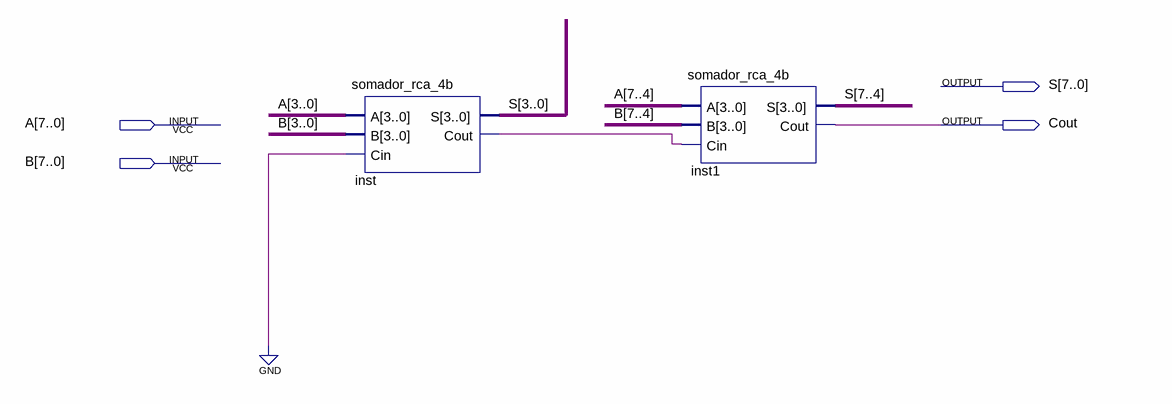
[diagram p0: schematic sheet]
// Quartus schematic somador_rca_8b.bdf as structural Verilog: 2 symbols, 4 pins
module somador_rca_8b (
  input  [7:0] A,
  input  [7:0] B,
  output [7:0] S,
  output Cout
);

  wire inst_cout;

  somador_rca_4b inst (.A(A[3:0]), .B(B[3:0]), .Cin(1'b0), .S(S[3:0]), .Cout(inst_cout));
  somador_rca_4b inst1 (.A(A[7:4]), .B(B[7:4]), .Cin(inst_cout), .S(S[7:4]), .Cout(Cout));
endmodule
